# Altium project QUANTUM_PCI_v1.PrjPcb (part 1 of 3)
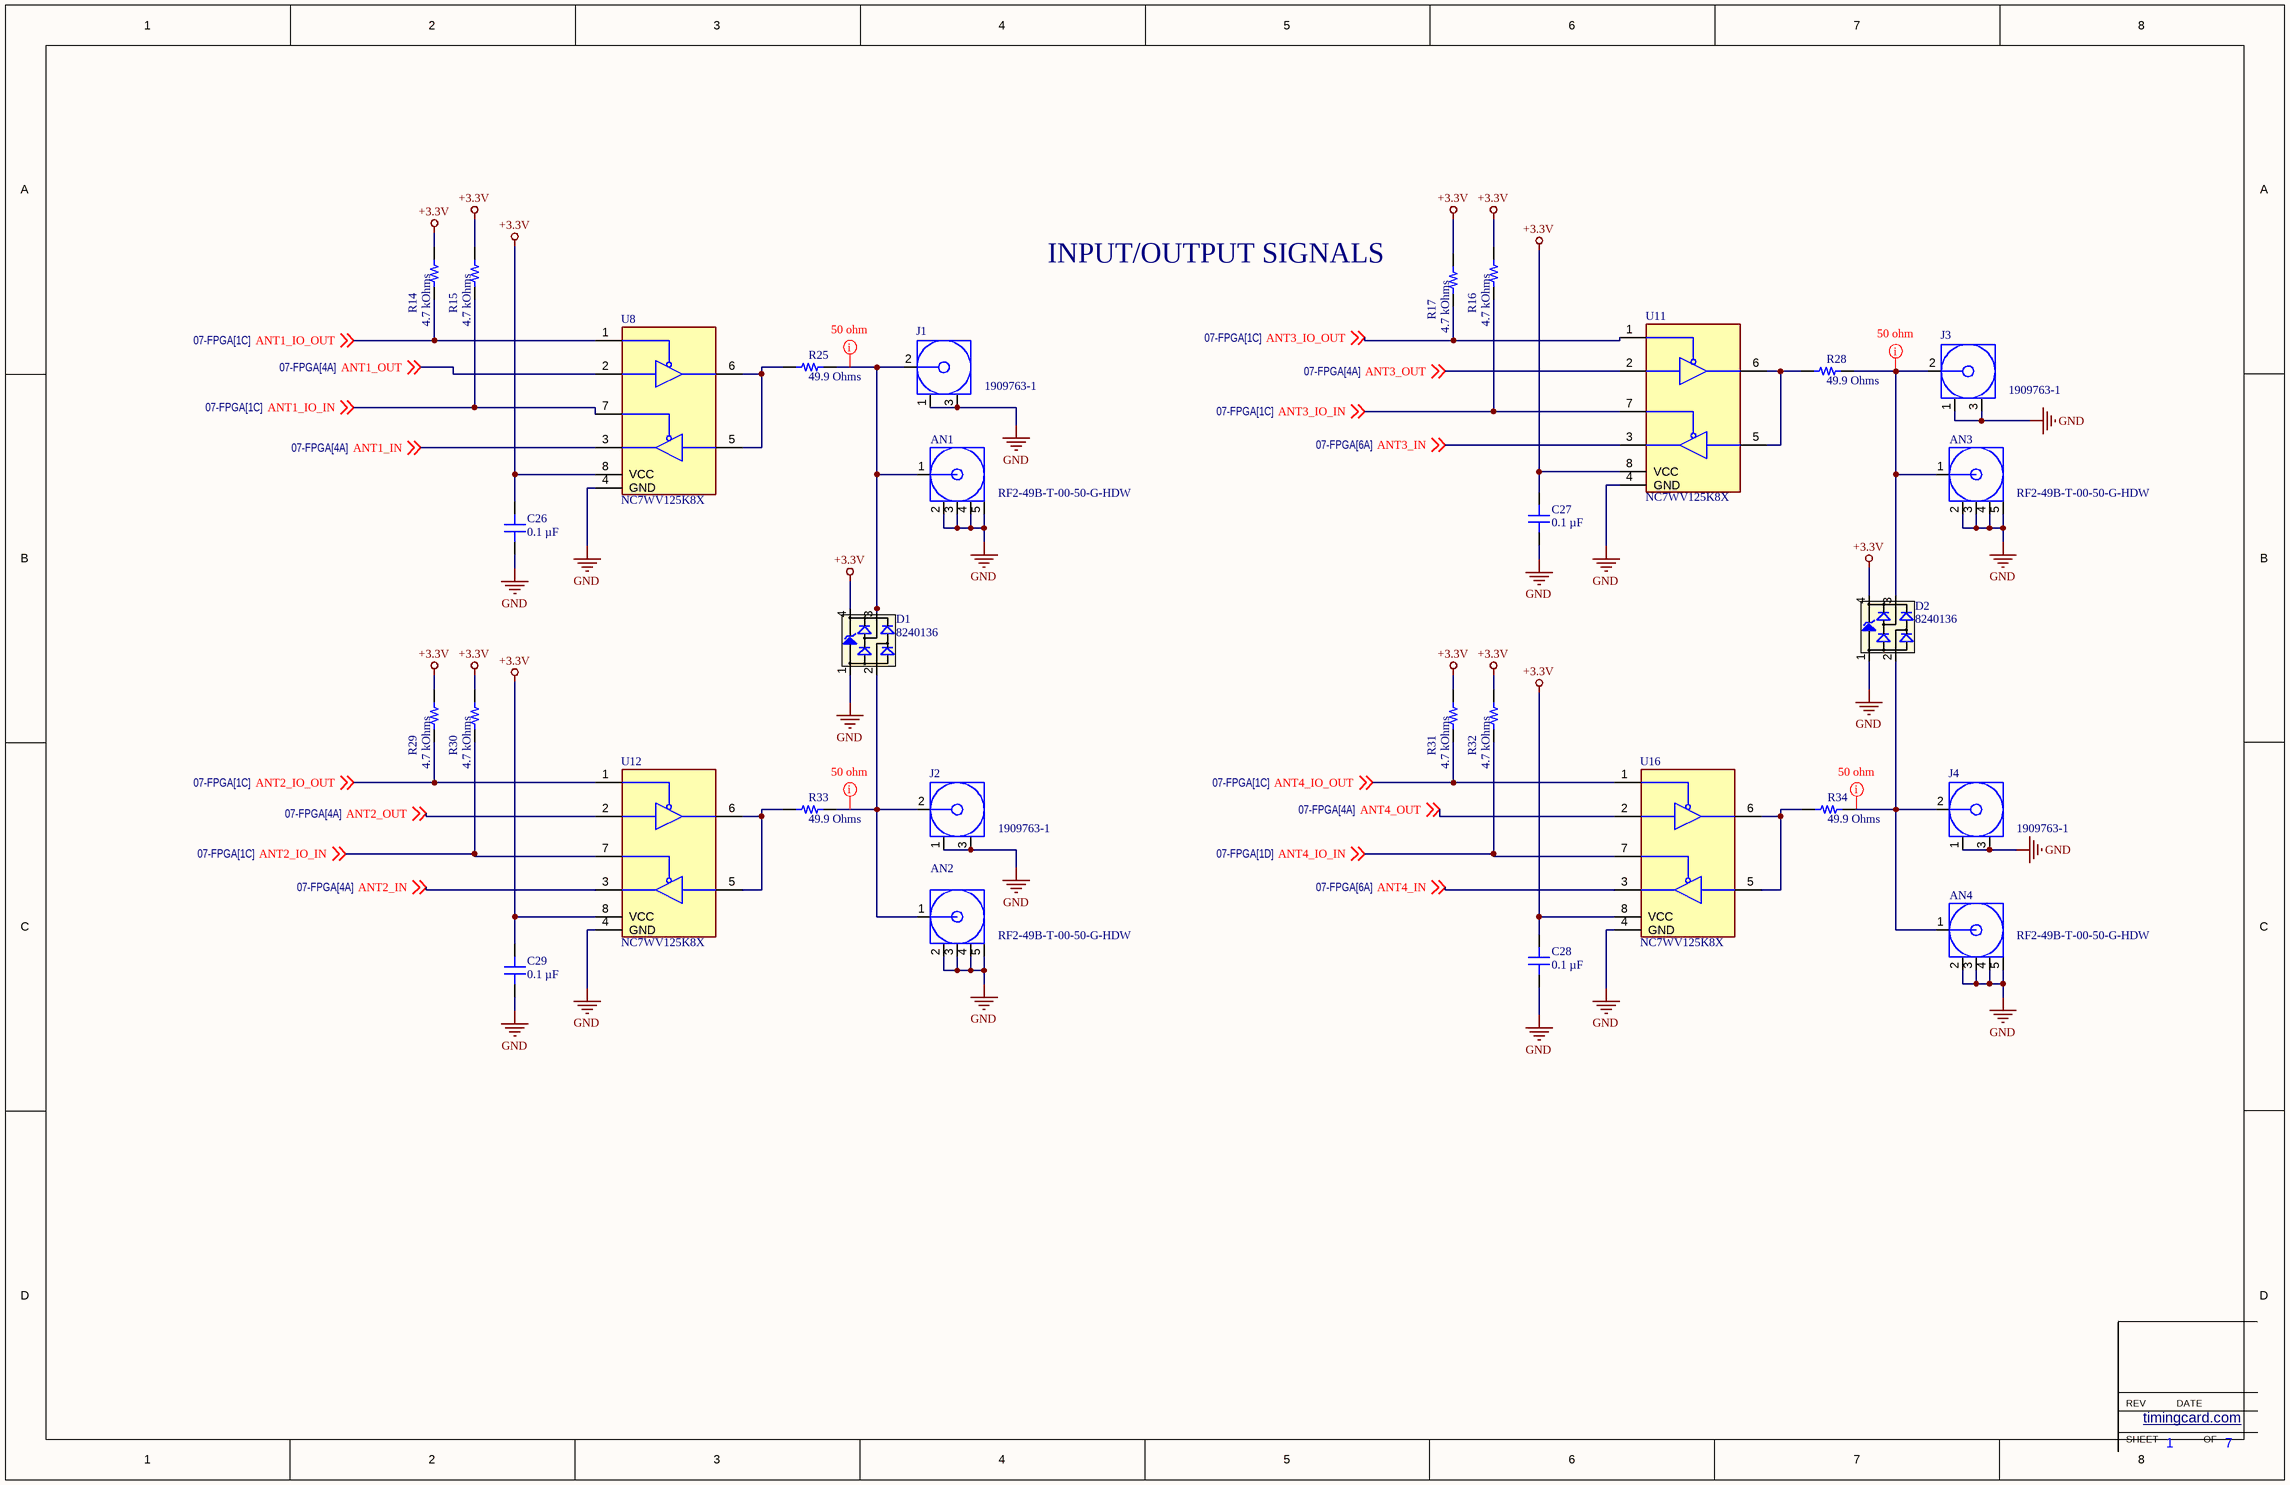
[diagram p0: 01-USER_IO.SchDoc]
TENSH: ТЕНШ.467883.01; Revision: Rev. 1.1
9 sheets, 379 parts. Net scope: global (net labels, ports and power ports of the same name join across sheets).
Board file: Quantum_PCI_v1.PcbDoc
Sheets:
  01-USER_IO.SchDoc
  03-POWER.SchDoc
  04-PCIe_JTAG.SchDoc
  05-GPS_IMU_SENSORS.SchDoc
  07-FPGA.SchDoc
  08-DIPSwitches_I2C.SchDoc
  09-USBUart_PPSMUX_UARTMUX.SchDoc
  10-M2_GPS.SchDoc
  11-M2_RCB_MUX.SchDoc

## Sheet 01-USER_IO.SchDoc
size Tabloid; DocumentNumber: 1; SheetNumber: 1; SheetTotal: 7

### Parts
AN1  RF2-49B-T-00-50-G-HDW  [RF249BT0050GHDW]
AN2  RF2-49B-T-00-50-G-HDW  [RF249BT0050GHDW]
AN3  RF2-49B-T-00-50-G-HDW  [RF249BT0050GHDW]
AN4  RF2-49B-T-00-50-G-HDW  [RF249BT0050GHDW]
C26  0.1 µF  [CAP 0402_1005]
C27  0.1 µF  [CAP 0402_1005]
C28  0.1 µF  [CAP 0402_1005]
C29  0.1 µF  [CAP 0402_1005]
D1  8240136  [SOT143-4L]
D2  8240136  [SOT143-4L]
J1  1909763-1  [TECO-1909763-1_V]
J2  1909763-1  [TECO-1909763-1_V]
J3  1909763-1  [TECO-1909763-1_V]
J4  1909763-1  [TECO-1909763-1_V]
R14  4.7 kOhms  [YAGEO RES 0402_1005]
R15  4.7 kOhms  [YAGEO RES 0402_1005]
R16  4.7 kOhms  [YAGEO RES 0402_1005]
R17  4.7 kOhms  [YAGEO RES 0402_1005]
R25  49.9 Ohms  [YAGEO RES 0402_1005]
R28  49.9 Ohms  [YAGEO RES 0402_1005]
R29  4.7 kOhms  [YAGEO RES 0402_1005]
R30  4.7 kOhms  [YAGEO RES 0402_1005]
R31  4.7 kOhms  [YAGEO RES 0402_1005]
R32  4.7 kOhms  [YAGEO RES 0402_1005]
R33  49.9 Ohms  [YAGEO RES 0402_1005]
R34  49.9 Ohms  [YAGEO RES 0402_1005]
U8  NC7WV125K8X  [SOP50P310X90-8N]
U11  NC7WV125K8X  [SOP50P310X90-8N]
U12  NC7WV125K8X  [SOP50P310X90-8N]
U16  NC7WV125K8X  [SOP50P310X90-8N]

### Nets
+3.3V: C26.1 C27.1 C28.1 C29.1 D1.4(VDD) D2.4(VDD) R14.1 R15.1 R16.1 R17.1 R29.1 R30.1 R31.1 R32.1 U8.8(VCC) U11.8(VCC) U12.8(VCC) U16.8(VCC)
GND: AN1.2 AN1.3 AN1.4 AN1.5 AN2.2 AN2.3 AN2.4 AN2.5 AN3.2 AN3.3 AN3.4 AN3.5 AN4.2 AN4.3 AN4.4 AN4.5 C26.2 C27.2 C28.2 C29.2 D1.1(GND) D2.1(GND) J1.1 J1.3 J2.1 J2.3 J3.1 J3.3 J4.1 J4.3 U8.4(GND) U11.4(GND) U12.4(GND) U16.4(GND)
ANT1_IN: U8.3 ; off-sheet ANT1_IN
ANT1_IO_IN: R15.2 U8.7 ; off-sheet ANT1_IO_IN
ANT1_IO_OUT: R14.2 U8.1 ; off-sheet ANT1_IO_OUT
ANT1_OUT: U8.2 ; off-sheet ANT1_OUT
ANT2_IN: U12.3 ; off-sheet ANT2_IN
ANT2_IO_IN: R30.2 U12.7 ; off-sheet ANT2_IO_IN
ANT2_IO_OUT: R29.2 U12.1 ; off-sheet ANT2_IO_OUT
ANT2_OUT: U12.2 ; off-sheet ANT2_OUT
ANT3_IN: U11.3 ; off-sheet ANT3_IN
ANT3_IO_IN: R16.2 U11.7 ; off-sheet ANT3_IO_IN
ANT3_IO_OUT: R17.2 U11.1 ; off-sheet ANT3_IO_OUT
ANT3_OUT: U11.2 ; off-sheet ANT3_OUT
ANT4_IN: U16.3 ; off-sheet ANT4_IN
ANT4_IO_IN: R32.2 U16.7 ; off-sheet ANT4_IO_IN
ANT4_IO_OUT: R31.2 U16.1 ; off-sheet ANT4_IO_OUT
ANT4_OUT: U16.2 ; off-sheet ANT4_OUT
NetAN1_1: AN1.1 D1.3(I/O2) J1.2 R25.2
NetAN2_1: AN2.1 D1.2(I/O1) J2.2 R33.2
NetAN3_1: AN3.1 D2.3(I/O2) J3.2 R28.2
NetAN4_1: AN4.1 D2.2(I/O1) J4.2 R34.2
NetR25_1: R25.1 U8.5 U8.6
NetR28_1: R28.1 U11.5 U11.6
NetR33_1: R33.1 U12.5 U12.6
NetR34_1: R34.1 U16.5 U16.6

### Layout directives
net class S50: NetAN1_1, NetAN2_1, NetAN3_1, NetAN4_1

### Notes on the sheet
- INPUT/OUTPUT SIGNALS
- SHEET
- REV
- timingcard.com <http://timingcard.com>
- DATE
- OF

### Library data of the parts
AN1-AN4 = RF2-49B-T-00-50-G-HDW: Connector; Manufacturer_Name: Adam Tech; Datasheet Link: https://www.digikey.com/en/products/detail/adam-tech/RF2-49B-T-00-50-G-HDW/9831420?msockid=3e3afa68a50969ca3057ef1ca4c9684b; Height: 10.958mm; Manufacturer_Part_Number: RF2-49B-T-00-50-G-HDW; Arrow Part Number: RF2-49B-T-00-50-G-HDW; Arrow Price/Stock: https://www.arrow.com/en/products/rf2-49b-t-00-50-g-hdw/adam-tech?region=nac
C26-C29 = CC0402KRX7R9BB104: CAP CER 0.1UF 50V X7R 0402; manufacturer: Yageo; Tolerance: ±10%; Capacitance: 0.1 µF; series: CC; packaging: TapeAndReel; Part Number: CC0402KRX7R9BB104; Value: 0.1 µF; Applications: General Purpose; componentlink1description: Datasheet; componentlink1url: https://www.yageo.com/upload/media/product/productsearch/datasheet/mlcc/UPY-GPHC_X7R_6.3V-to-50V_18.pdf; componentlink2description: DigiKey Link; componentlink2url: https://www.digikey.com/en/products/detail/yageo/CC0402KRX7R9BB104/5883371; Device Package: 0402 (1005 Metric); lastupdated: 09.02.2024 20:04:27; Lifecycle Status: Active; Minimum Order: 10; Mounting Type: Surface Mount, MLCC; Operating Temperature: -55°C ~ 125°C; Package / Case: 0402 (1005 Metric); partid: 8451; Part Status: Active; price: 0.01; Size / Dimension: 0.039" L x 0.020" W (1.00mm x 0.50mm); Supplier 1: DigiKey; Supplier Part Number 1: 311-3566-1-ND; Temperature Coefficient: X7R; Thickness (Max): 0.022" (0.55mm); Voltage - Rated: 50V
D1 D2 = CMP-1486-00002-1: TVS Diode WE-TVS-HS, VRWM=3.3V; Manufacturer: Wuerth Elektronik; Reverse Stand Off Voltage: 3.3V; PartNumber: 8240136; ComponentLink1Description: Manufacturer URL; PackageReference: SOT143-4L; ComponentLink1URL: http://www.we-online.com; ComponentLink2Description: Datasheet; ComponentLink2URL: http://katalog.we-online.de/kataloge/eisos/media/pdf/8240136.pdf
J1-J4 = CMP-2000-07505-1: Ultra Miniature Coaxial Connector Jack, 60 V, 50 Ohm, -40 to 90 degC, RoHS, Tape and Reel; Manufacturer: TE Connectivity; Gender: Female; PCB Mounting Orientation: Vertical; Body Material: LiquidCrystalPolymer; Case\/Package: SMD/SMT; Impedance: 50Ohm; Max Frequency: 6GHz; Body Plating: Gold; Dielectric Material: Polymer; Orientation: Straight; Mount: SurfaceMount; Length: 3mm; Packaging: TapeandReel; Connector Type: Jack; Lead Free: LeadFree; Package Quantity: 1; Termination: SMD/SMT; Contact Material: CopperAlloy; Fastening Type: Pull; RoHSCompliant: true; Max Operating Temperature: 90degC; Datasheet URL: http://www.te.com/commerce/DocumentDelivery/DDEController?Action=srchrtrv&DocNm=1909763&DocType=Customer+Drawing&DocLang=English; Contact Plating: Gold; Mounting Technology: SurfaceMount; Package Reference: TECO-1909763-1; Insulation Material: Thermoplastic; Min Operating Temperature: -40degC; Manufacturer URL: http://www.te.com/; ELV: Compliant; Datasheet Version: Rev. B2, 11/2015; Radiation Hardening: No; Package Description: 3-Pin Surface Mount Device, Body 2.6 x 2.6 mm; Housing Colour: Beige
R14-R17 R29-R32 = RC0402FR-074K7L: RES 4.7K OHM 1% 1/16W 0402; Manufacturer: Yageo; Power (Watts): 0.063W, 1/16W; Temperature Coefficient: ±100ppm/°C; Part Number: RC0402FR-074K7L; Value: 4.7 kOhms; ComponentLink1Description: Datasheet; ComponentLink1URL: https://www.yageo.com/upload/media/product/productsearch/datasheet/rchip/PYu-RC_Group_51_RoHS_L_10.pdf; ComponentLink2Description: DigiKey Link; ComponentLink2URL: https://www.digikey.com/en/products/detail/yageo/RC0402FR-074K7L/2827563; Composition: Thick Film; Device Package: 0402 (1005 Metric); Features: Moisture Resistant; Height - Seated (Max): 0.016" (0.40mm); LastUpdated: 25.07.2024 9:18:11; Lifecycle Status: Active; Minimum Order: 1; Number of Terminations: 2; Operating Temperature: -55°C ~ 155°C; Package / Case: 0402 (1005 Metric); Packaging: CutTape; PartId: 17603; Part Status: Active; Price: 0.01; Resistance: 4.7 kOhms; Series: RC_L; Size / Dimension: 0.039" L x 0.020" W (1.00mm x 0.50mm); Supplier 1: DigiKey; Supplier Part Number 1: 311-4.7KLRCT-ND; Supplier Device Package: 0402; Tolerance: ±1%
R25 R28 R33 R34 = RC0402FR-0749R9L: RES 49.9 OHM 1% 1/16W 0402; Manufacturer: Yageo; Power (Watts): 0.063W, 1/16W; Temperature Coefficient: ±100ppm/°C; Packaging: CutTape; ComponentLink2Description: DigiKey Link; ComponentLink1Description: Datasheet; ComponentLink2URL: https://www.digikey.com/en/products/detail/yageo/RC0402FR-0749R9L/726621; ComponentLink1URL: https://www.yageo.com/upload/media/product/productsearch/datasheet/rchip/PYu-RC_Group_51_RoHS_L_10.pdf; Part Number: RC0402FR-0749R9L; Value: 49.9 Ohms; Composition: Thick Film; Device Package: 0402 (1005 Metric); Features: Moisture Resistant; Height - Seated (Max): 0.016" (0.40mm); LastUpdated: 25.07.2024 9:18:11; Lifecycle Status: Active; Minimum Order: 1; Number of Terminations: 2; Operating Temperature: -55°C ~ 155°C; Package / Case: 0402 (1005 Metric); PartId: 17605; Part Status: Active; Price: 0.01; Resistance: 49.9 Ohms; Series: RC_L; Size / Dimension: 0.039" L x 0.020" W (1.00mm x 0.50mm); Supplier 1: DigiKey; Supplier Part Number 1: 311-49.9LRCT-ND; Supplier Device Package: 0402; Tolerance: ±1%
U8 U11 U12 U16 = NC7WV125K8X: Integrated Circuit; Manufacturer_Name: ON Semiconductor; Datasheet Link: https://www.mouser.com/datasheet/2/308/NC7WV125-1301459.pdf; Height: 0.9mm; Manufacturer_Part_Number: NC7WV125K8X; Mouser Part Number: 512-NC7WV125K8X; Mouser Price/Stock: https://www.mouser.com/Search/Refine.aspx?Keyword=512-NC7WV125K8X; Arrow Part Number: NC7WV125K8X; Arrow Price/Stock: https://www.arrow.com/en/products/nc7wv125k8x/on-semiconductor

## Sheet 03-POWER.SchDoc
size A2; Customer: 01910; SPICEModelCache: <root> / <DocumentId>GNEMVTBT</DocumentId> / <CacheFrame Number="0"> / <Model Name="emk105bj105_v-f" Kind="CKT"> / <Text>* EMK105BJ105_V-F     SPICE MODEL  ( General Type ) / *-------------------------------------------------------------------------------------------------------- / * Model Generated by TAIYO YUDEN Corporation (http://www.ty-top.com) / * Version 1.0 / * TAIYO YUDEN Control No. 170508_130520 / * Copyright(c) 2012 TAIYO YUDEN CO.,LTD. All Rights Reserved. / *-------------------------------------------------------------------------------------------------------- / * / * Products Name : Multilayer Ceramic Capacitors / * / * Characteristics : / *     Capacitance : 1 uF , Rated Voltage : 16V , TCC : X5R / *     Case Size : 1.0 x 0.5 / 0.039 x 0.02 [mm/inch] , Thickness : 0.5 / 0.02 [mm/inch] / *     (Conditions: Temperature = 25 degC , DC Bias Current/Voltage = 0A / 0V) / * / * Frequency Range : 40Hz - 3GHz / * / * External Node Assignments : / * / *  1  o---| |---o  2 / * / *-------------------------------------------------------------------------------------------------------- / .SubCkt EMK105BJ105_V-F 1 2 / **************************** / C0 1 110 0.68309u / Cm 1 101 0.26053u / C1 101 102 0.94076u / Rc1 101 102 1.9029k / C2 102 103 0.66707u / Rc2 102 103 120.36 / C3 103 110 0.57203u / Rc3 103 110 2.1097 / C2m 1 301 0.1871u / C21 301 302 3.2494u / Rc21 301 302 1.1117k / C22 302 303 2.1014u / Rc22 302 303 1.484k / C23 303 304 2.1172u / Rc23 303 304 1.3876k / C24 304 305 0.75729u / Rc24 304 305 332.59 / C25 305 306 0.94401u / Rc25 305 306 249.09 / C26 306 307 0.34674u / Rc26 306 307 28.352 / C27 307 308 0.37158u / Rc27 307 308 19.989 / C28 308 309 0.17933u / Rc28 308 309 31.748 / C29 309 110 0.016445u / Rc29 309 110 1.0592 / Rp0 1 110 100Meg / L0 110 120 0.2216n / Lm 120 130 0.1509n / L1 120 121 0.12659n / RL1 121 130 0.85161 / L2 120 122 0.15996n / RL2 122 130 0.42469 / L3 120 123 7.9543n / RL3 123 130 0.54643m / CR 120 124 0.24334u / LR 124 125 0.090738n / RR 125 130 68.076m / CL 130 140 2.7354p / LL 130 140 0.10762n / RL 130 140 50.614 / Rs 140 2 7.5416m / **************************** / .ends EMK105BJ105_V-F</Text> / </Model> / </CacheFrame> / </root>
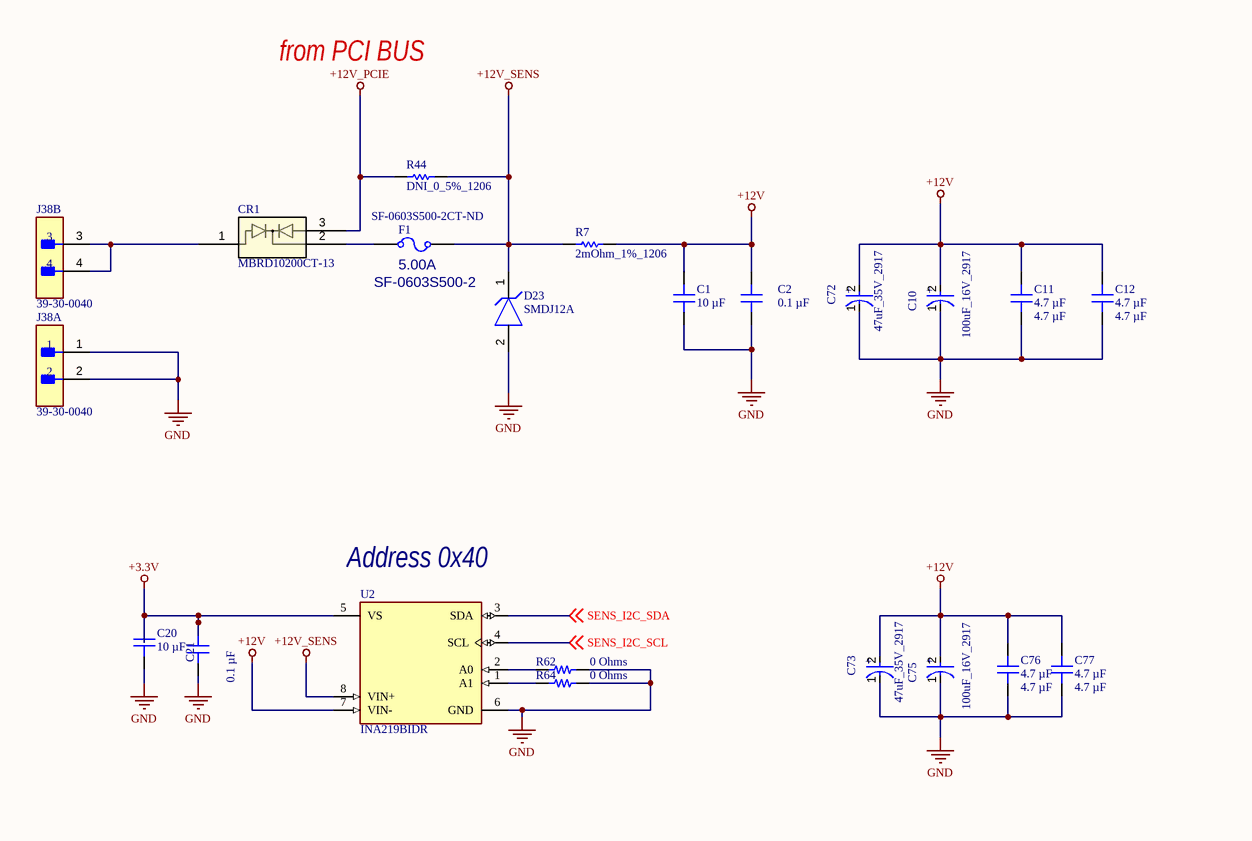
[diagram p1: 03-POWER.SchDoc, left]
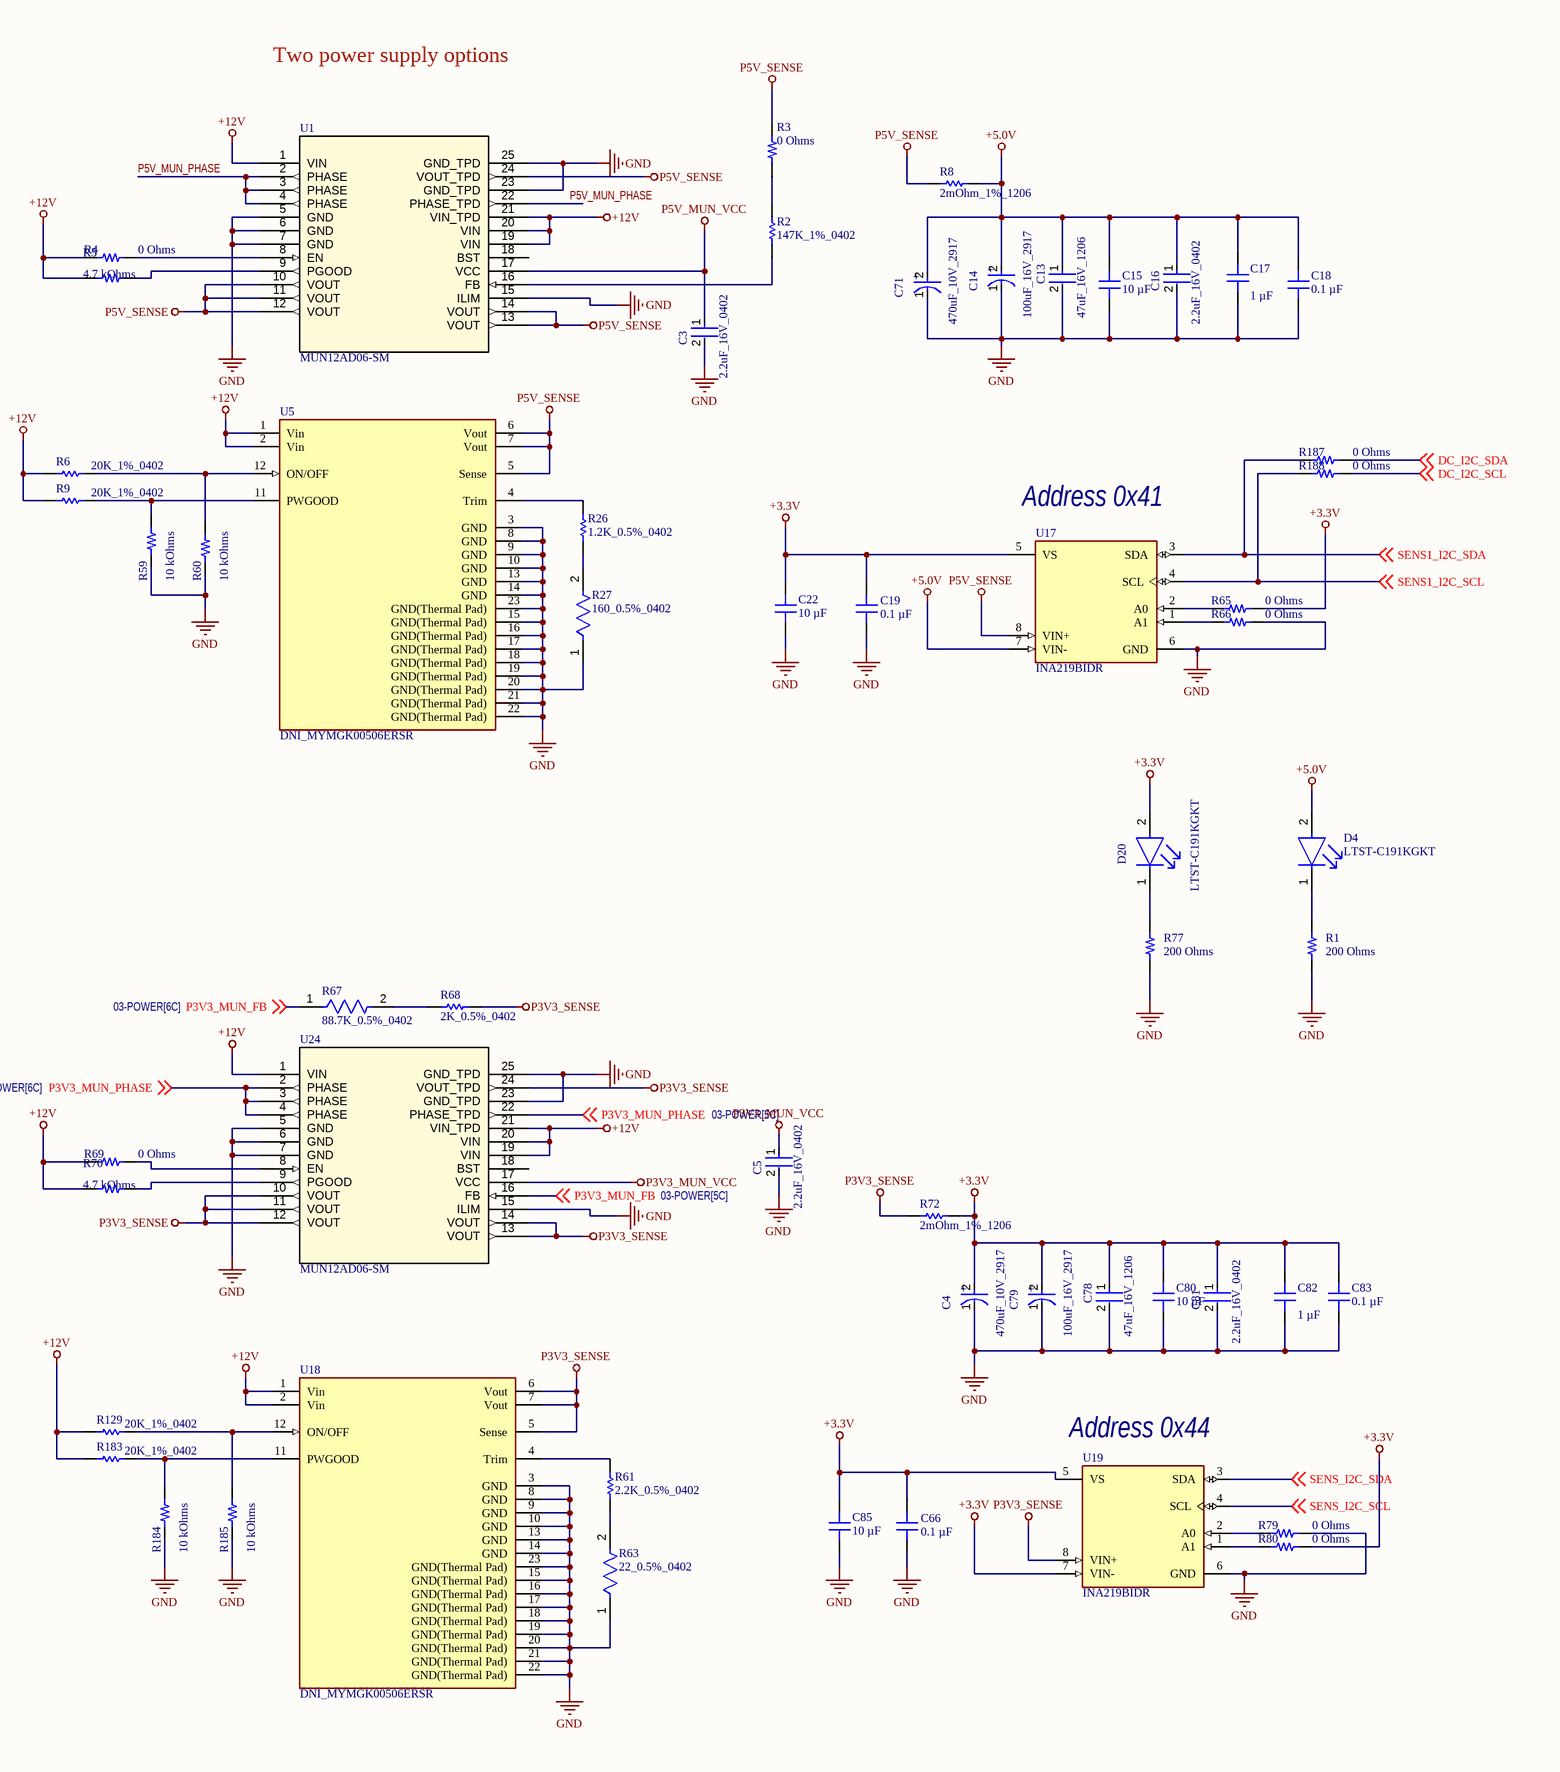
[diagram p2: 03-POWER.SchDoc, right]

### Parts
C1  10 µF  [MURATA GRM21B 0805_2012]
C2  0.1 µF  [CAP 0402_1005]
C3  2.2uF_16V_0402  [FP-C1005-050-0_05-IPC_A]
C4  470uF_10V_2917  [FP-TAJE-MFG]
C5  2.2uF_16V_0402  [FP-C1005-050-0_05-IPC_A]
C10  100uF_16V_2917  [FP-T495D107K016ATE125-MFG]
C11  4.7 µF  [MURATA CAP GRM31C 1206_3216]
C12  4.7 µF  [MURATA CAP GRM31C 1206_3216]
C13  47uF_16V_1206  [FP-C3216-160-0_2-MFG]
C14  100uF_16V_2917  [FP-T495D107K016ATE125-MFG]
C15  10 µF  [MURATA GRM21B 0805_2012]
C16  2.2uF_16V_0402  [FP-C1005-050-0_05-IPC_A]
C17  1 µF  [CAP 0402_1005]
C18  0.1 µF  [CAP 0402_1005]
C19  0.1 µF  [CAP 0402_1005]
C20  10 µF  [MURATA GRM21B 0805_2012]
C21  0.1 µF  [CAP 0402_1005]
C22  10 µF  [MURATA GRM21B 0805_2012]
C66  0.1 µF  [CAP 0402_1005]
C71  470uF_10V_2917  [FP-TAJE-MFG]
C72  47uF_35V_2917  [FP-T521X476M035ATE030-MFG]
C73  47uF_35V_2917  [FP-T521X476M035ATE030-MFG]
C75  100uF_16V_2917  [FP-T495D107K016ATE125-MFG]
C76  4.7 µF  [MURATA CAP GRM31C 1206_3216]
C77  4.7 µF  [MURATA CAP GRM31C 1206_3216]
C78  47uF_16V_1206  [FP-C3216-160-0_2-MFG]
C79  100uF_16V_2917  [FP-T495D107K016ATE125-MFG]
C80  10 µF  [MURATA GRM21B 0805_2012]
C81  2.2uF_16V_0402  [FP-C1005-050-0_05-IPC_A]
C82  1 µF  [CAP 0402_1005]
C83  0.1 µF  [CAP 0402_1005]
C85  10 µF  [MURATA GRM21B 0805_2012]
CR1  MBRD10200CT-13  [TO252(DPAK)_DIO]
D4  LTST-C191KGKT  [FP-LTST-C191KGKT-MFG]
D20  LTST-C191KGKT  [FP-LTST-C191KGKT-MFG]
D23  SMDJ12A  [FP-DO-214AB_SMC_J-Bend-MFG]
F1  value 5.00A  MFG PART NUM: SF-0603S500-2  Supplier Part Number 1: SF-0603S500-2CT-ND  [FUSM1608X60N]  (hidden comment: FUSE_0603_5.00A)
J38  39-30-0040  [FP-39-30-0040-MFG]  (parts A,B of 2)
R1  200 Ohms  [YAGEO RES 0402_1005]
R2  147K_1%_0402  [RESC1005X40X25ML05T10]
R3  0 Ohms  [YAGEO RES 0402_1005]
R4  0 Ohms  [YAGEO RES 0402_1005]
R5  4.7 kOhms  [YAGEO RES 0402_1005]
R6  20K_1%_0402  [RESC1005X40X25NL10T10]
R7  2mOhm_1%_1206  [RESC3216X89X64NL25T25]
R8  2mOhm_1%_1206  [RESC3216X89X64NL25T25]
R9  20K_1%_0402  [RESC1005X40X25NL10T10]
R26  1.2K_0.5%_0402  [RESC1005X40X25ML10T10]
R27  160_0.5%_0402  [FP-RT0402-MFG]
R44  DNI_0_5%_1206  [RESC3116X65X50ML20T20]  (no BOM)
R59  10 kOhms  [YAGEO RES 0402_1005]
R60  10 kOhms  [YAGEO RES 0402_1005]
R61  2.2K_0.5%_0402  [RESC1005X40X25ML10T10]
R62  0 Ohms  [YAGEO RES 0402_1005]
R63  22_0.5%_0402  [FP-RG1005-IPC_A]
R64  0 Ohms  [YAGEO RES 0402_1005]
R65  0 Ohms  [YAGEO RES 0402_1005]
R66  0 Ohms  [YAGEO RES 0402_1005]
R67  88.7K_0.5%_0402  [FP-RT0402-MFG]
R68  2K_0.5%_0402  [RESC1005X35X25LL10T10]
R69  0 Ohms  [YAGEO RES 0402_1005]
R70  4.7 kOhms  [YAGEO RES 0402_1005]
R72  2mOhm_1%_1206  [RESC3216X89X64NL25T25]
R77  200 Ohms  [YAGEO RES 0402_1005]
R79  0 Ohms  [YAGEO RES 0402_1005]
R80  0 Ohms  [YAGEO RES 0402_1005]
R129  20K_1%_0402  [RESC1005X40X25NL10T10]
R183  20K_1%_0402  [RESC1005X40X25NL10T10]
R184  10 kOhms  [YAGEO RES 0402_1005]
R185  10 kOhms  [YAGEO RES 0402_1005]
R187  0 Ohms  [YAGEO RES 0402_1005]
R188  0 Ohms  [YAGEO RES 0402_1005]
U1  MUN12AD06-SM  [MUN12AD06-SM_CYN]
U2  INA219BIDR  [FP-D0008A-MFG]
U5  DNI_MYMGK00506ERSR  [FP-MYMGK-12-MFG]  (no BOM)
U17  INA219BIDR  [FP-D0008A-MFG]
U18  DNI_MYMGK00506ERSR  [FP-MYMGK-12-MFG]  (no BOM)
U19  INA219BIDR  [FP-D0008A-MFG]
U24  MUN12AD06-SM  [MUN12AD06-SM_CYN]

### Nets
+3.3V: C4.2(A) C19.2 C20.2 C21.2 C22.2 C66.2 C78.1 C79.2(A) C80.2 C81.1 C82.2 C83.1 C85.2 D20.2(A) R65.2 R72.2 R80.2 U2.5(VS) U17.5(VS) U19.5(VS) U19.7(VIN-)
+5.0V: C13.1 C14.2(A) C15.2 C16.1 C17.2 C18.1 C71.2(A) D4.2(A) R8.2 U17.7(VIN-)
+12V: C1.1 C2.2 C10.2(A) C11.2 C12.2 C72.2(A) C73.2(A) C75.2(A) C76.2 C77.2 R4.1 R5.2 R6.1 R7.2 R9.1 R69.1 R70.2 R129.1 R183.1 U1.1(VIN) U1.19(VIN) U1.20(VIN) U1.21(VIN_TPD) U2.7(VIN-) U5.1(Vin) U5.2(Vin) U18.1(Vin) U18.2(Vin) U24.1(VIN) U24.19(VIN) U24.20(VIN) U24.21(VIN_TPD)
+12V_PCIE: CR1.3 R44.1
+12V_SENS: D23.1(C) F1.2 R7.1 R44.2 U2.8(VIN+)
GND: C1.2 C2.1 C3.2 C4.1(C) C5.2 C10.1(C) C11.1 C12.1 C13.2 C14.1(C) C15.1 C16.2 C17.1 C18.2 C19.1 C20.1 C21.1 C22.1 C66.1 C71.1(C) C72.1(C) C73.1(C) C75.1(C) C76.1 C77.1 C78.2 C79.1(C) C80.1 C81.2 C82.1 C83.2 C85.1 D23.2(A) J38.1 J38.2 R1.1 R27.1 R59.1 R60.1 R62.2 R63.1 R64.2 R66.2 R77.1 R79.2 R184.1 R185.1 U1.5(GND) U1.6(GND) U1.7(GND) U1.15(ILIM) U1.23(GND_TPD) U1.25(GND_TPD) U2.6(GND) U5.3(GND) U5.8(GND) U5.9(GND) U5.10(GND) U5.13(GND) U5.14(GND) U5.15(GND(Thermal_Pad)) U5.16(GND(Thermal_Pad)) U5.17(GND(Thermal_Pad)) U5.18(GND(Thermal_Pad)) U5.19(GND(Thermal_Pad)) U5.20(GND(Thermal_Pad)) U5.21(GND(Thermal_Pad)) U5.22(GND(Thermal_Pad)) U5.23(GND(Thermal_Pad)) U17.6(GND) U18.3(GND) U18.8(GND) U18.9(GND) U18.10(GND) U18.13(GND) U18.14(GND) U18.15(GND(Thermal_Pad)) U18.16(GND(Thermal_Pad)) U18.17(GND(Thermal_Pad)) U18.18(GND(Thermal_Pad)) U18.19(GND(Thermal_Pad)) U18.20(GND(Thermal_Pad)) U18.21(GND(Thermal_Pad)) U18.22(GND(Thermal_Pad)) U18.23(GND(Thermal_Pad)) U19.6(GND) U24.5(GND) U24.6(GND) U24.7(GND) U24.15(ILIM) U24.23(GND_TPD) U24.25(GND_TPD)
P3V3_MUN_VCC: C5.1 U24.17(VCC)
P3V3_SENSE: R68.2 R72.1 U18.5(Sense) U18.6(Vout) U18.7(Vout) U19.8(VIN+) U24.10(VOUT) U24.11(VOUT) U24.12(VOUT) U24.13(VOUT) U24.14(VOUT) U24.24(VOUT_TPD)
P5V_MUN_VCC: C3.1 U1.17(VCC)
P5V_SENSE: R3.2 R8.1 U1.10(VOUT) U1.11(VOUT) U1.12(VOUT) U1.13(VOUT) U1.14(VOUT) U1.24(VOUT_TPD) U5.5(Sense) U5.6(Vout) U5.7(Vout) U17.8(VIN+)
DC_I2C_SCL: R188.2 ; off-sheet DC_I2C_SCL
DC_I2C_SDA: R187.2 ; off-sheet DC_I2C_SDA
P3V3_MUN_FB: R67.1 U24.16(FB) ; off-sheet P3V3_MUN_FB
P3V3_MUN_PHASE: U24.2(PHASE) U24.3(PHASE) U24.4(PHASE) U24.22(PHASE_TPD) ; off-sheet P3V3_MUN_PHASE
P5V_MUN_PHASE: U1.2(PHASE) U1.3(PHASE) U1.4(PHASE) U1.22(PHASE_TPD)
SENS1_I2C_SCL: R188.1 U17.4(SCL) ; off-sheet SENS1_I2C_SCL
SENS1_I2C_SDA: R187.1 U17.3(SDA) ; off-sheet SENS1_I2C_SDA
SENS_I2C_SCL: U2.4(SCL) U19.4(SCL) ; off-sheet SENS_I2C_SCL
SENS_I2C_SDA: U2.3(SDA) U19.3(SDA) ; off-sheet SENS_I2C_SDA
NetCR1_1: CR1.1 J38.3 J38.4
NetCR1_2: CR1.2 F1.1
NetD4_1: D4.1(C) R1.2
NetD20_1: D20.1(C) R77.2
NetR2_1: R2.1 U1.16(FB)
NetR2_2: R2.2 R3.1
NetR4_2: R4.2 U1.8(EN)
NetR5_1: R5.1 U1.9(PGOOD)
NetR6_2: R6.2 R60.2 U5.12(ON/OFF)
NetR9_2: R9.2 R59.2 U5.11(PWGOOD)
NetR26_1: R26.1 R27.2
NetR26_2: R26.2 U5.4(Trim)
NetR61_1: R61.1 R63.2
NetR61_2: R61.2 U18.4(Trim)
NetR62_1: R62.1 U2.2(A0)
NetR64_1: R64.1 U2.1(A1)
NetR65_1: R65.1 U17.2(A0)
NetR66_1: R66.1 U17.1(A1)
NetR67_2: R67.2 R68.1
NetR69_2: R69.2 U24.8(EN)
NetR70_1: R70.1 U24.9(PGOOD)
NetR79_1: R79.1 U19.2(A0)
NetR80_1: R80.1 U19.1(A1)
NetR129_2: R129.2 R185.2 U18.12(ON/OFF)
NetR183_2: R183.2 R184.2 U18.11(PWGOOD)

Not connected (* = marked no-connect by the designer): U1 18(BST); U24 18(BST)

### Notes on the sheet
- from PCI BUS
- Two power supply options
- (near U2) Address 0x40
- (near U17) Address 0x41
- (near U19) Address 0x44
- SHEET
- REV
- timingcard.com <http://timingcard.com>
- DATE
- OF
- (in symbol CMP-2000-07207-2) +
- (in symbol CMP-03016-000019-1) +
- (in symbol CMP-04424-000243-1) +

### Library data of the parts
C1 C15 C20 C22 C80 C85 = GRM21BR61E106KA73L: CAP CER 10UF 25V X5R 0805; manufacturer: Murata Electronics; Tolerance: ±10%; Supplier 1: DigiKey; Supplier Part Number 1: 490-5523-1-ND; Value: 10 µF; Part Number: GRM21BR61E106KA73L; Applications: General Purpose; Capacitance: 10 µF; componentlink1description: Datasheet; componentlink1url: https://search.murata.co.jp/Ceramy/image/img/A01X/G101/ENG/GRM21BR61E106KA73-01.pdf; componentlink2description: DigiKey Link; componentlink2url: https://www.digikey.com/en/products/detail/murata-electronics/GRM21BR61E106KA73L/2334874; Device Package: 0805 (2012 Metric); lastupdated: 27.08.2024 9:29:56; Lifecycle Status: Active; Minimum Order: 1; Mounting Type: Surface Mount, MLCC; Operating Temperature: -55°C ~ 85°C; Package / Case: 0805 (2012 Metric); packaging: TapeAndReel; partid: 8913; Part Status: Active; price: 0.04; series: GRM; Size / Dimension: 0.079" L x 0.049" W (2.00mm x 1.25mm); Temperature Coefficient: X5R; Thickness (Max): 0.053" (1.35mm); Voltage - Rated: 25V
C2 C18 C19 C21 C66 C83 = CC0402KRX7R9BB104: as C26 on sheet 01-USER_IO; Part Number: CC0402KRX7R9BB104; Value: 0.1 µF; Applications: General Purpose; Capacitance: 0.1 µF; componentlink1description: Datasheet; componentlink1url: https://www.yageo.com/upload/media/product/productsearch/datasheet/mlcc/UPY-GPHC_X7R_6.3V-to-50V_18.pdf; componentlink2description: DigiKey Link; componentlink2url: https://www.digikey.com/en/products/detail/yageo/CC0402KRX7R9BB104/5883371; Device Package: 0402 (1005 Metric); lastupdated: 09.02.2024 20:04:27; Lifecycle Status: Active; Minimum Order: 10; Mounting Type: Surface Mount, MLCC; Operating Temperature: -55°C ~ 125°C; Package / Case: 0402 (1005 Metric); packaging: TapeAndReel; partid: 8451; Part Status: Active; price: 0.01; series: CC; Size / Dimension: 0.039" L x 0.020" W (1.00mm x 0.50mm); Supplier 1: DigiKey; Supplier Part Number 1: 311-3566-1-ND; Temperature Coefficient: X7R; Thickness (Max): 0.022" (0.55mm); Voltage - Rated: 50V
C3 C5 C16 C81 = CMP-2000-05998-2: Multilayer Ceramic Capacitors 2.2μF ±10% 16V X5R SMD 0402; Capacitance: 2.2uF; REACH SVHC: No SVHC; Series: C; Termination: SMD/SMT; Case Code (Imperial): 0402; Depth: 0.5mm; Mount: Surface Mount; Width: 0.02inch; Package Quantity: 1; Dielectric Material: Ceramic; Length: 1mm; Packaging: Tape and Reel; Case Code (Metric): 1005; RoHS Compliant: Yes; Dielectric: X5R; Max Operating Temperature: 85°C; Lead Free: Lead Free; Weight: 2.3E-05oz; Thickness: 0.022inch; Voltage Rating (DC): 16V; Tolerance: 10%; Voltage Rating: 16V; Resistor Type: Ceramic; Height: 0.5mm; Case/Package: 0402; Min Operating Temperature: -55°C
C4 C71 = CMP-04424-000243-1: 470uF 10V  ±10% 500mΩ 2917  SMD Tantalum Capacitor; Leakage Current: 47uA; ESR (Equivalent Series Resistance): 500mR; Polarity: Polar; Construction: Flat; Width: 4.3mm; Mount: Surface Mount; Tolerance: 10%; Max Operating Temperature: 125°C; Min Operating Temperature: -55°C; Length: 7.3mm; Voltage: 10V; Dissipation Factor: 10%; REACH SVHC: No SVHC; Lead Free: Lead Free; Case/Package: 2917; Voltage Rating: 10V; Capacitance: 470uF; Series: TAJ; Height: 4.1mm; RoHS Compliant: Yes; Packaging: Tape and Reel; Voltage Rating (DC): 10V; Radiation Hardening: No; Dielectric Material: Tantalum; Number of Pins: 2; Depth: 4.3mm; Case Code (Metric): 7343; Case Code (Imperial): 2917; Termination: SMD/SMT; Lead Pitch: 4.4mm; Features: General Purpose; Height - Seated (Max): 0.169inch; Package Quantity: 1
C10 C14 C75 C79 = CMP-2000-07207-2: CAP TANT 100UF 10% 16V 2917; Life (Hours): 2000Hour; ESR (Equivalent Series Resistance): 125mR; Polarity: Polar; Dielectric Material: Tantalum; Dissipation Factor: 8%; Capacitance: 100uF; Radiation Hardening: No; RoHS Compliant: Yes; Length: 7.3mm; Features: General Purpose; Packaging: Tape and Reel; Package Quantity: 1; Weight: 0.023634oz; Voltage Rating: 16V; Width: 0.169inch; Case/Package: 2917; Mount: Surface Mount; Voltage: 16V; Min Operating Temperature: -55°C; Tolerance: 10%; REACH SVHC: No SVHC; Height - Seated (Max): 0.122inch; Number of Pins: 2; Construction: Flat; Depth: 4.3mm; Series: T495; Max Operating Temperature: 125°C; Failure Rate: 0.001%; Termination: SMD/SMT; Voltage Rating (DC): 16V; Case Code (Imperial): 2917; Case Code (Metric): 7343; Height: 2.8mm
C11 C12 C76 C77 = GRM31CR71H475KA12L: CAP CER 4.7UF 50V X7R 1206; manufacturer: Murata Electronics; Tolerance: ±10%; Capacitance: 4.7 µF; packaging: TapeAndReel; Part Number: GRM31CR71H475KA12L; Value: 4.7 µF; Applications: General Purpose; componentlink1description: Datasheet; componentlink1url: https://www.murata.com/~/media/webrenewal/support/library/catalog/products/capacitor/mlcc/c02e.ashx?la=en-us; componentlink2description: DigiKey Link; componentlink2url: https://www.digikey.com/en/products/detail/murata-electronics/GRM31CR71H475KA12L/2548209; Device Package: 1206 (3216 Metric); lastupdated: 06.09.2024 2:27:23; Lifecycle Status: Active; Minimum Order: 1; Mounting Type: Surface Mount, MLCC; Operating Temperature: -55°C ~ 125°C; Package / Case: 1206 (3216 Metric); partid: 20010; Part Status: Active; price: 0.07; series: GRM; Size / Dimension: 0.126" L x 0.063" W (3.20mm x 1.60mm); Supplier 1: DigiKey; Supplier Part Number 1: 490-6521-1-ND; Temperature Coefficient: X7R; Thickness (Max): 0.071" (1.80mm); Voltage - Rated: 50V
C13 C78 = CMP-2000-07442-2: Multilayer Ceramic Capacitors 47uF ±20% 16V X5R SMD 1206; Resistor Type: Ceramic; Width: 0.063inch; Case Code (Imperial): 1206; Radiation Hardening: No; Thickness: 0.071inch; Dielectric: X5R; Weight: 0.000571oz; Termination: SMD/SMT; Dielectric Material: Ceramic; Min Operating Temperature: -55°C; Depth: 1.6mm; Case Code (Metric): 3216; Max Operating Temperature: 85°C; RoHS Compliant: Yes; REACH SVHC: No SVHC; Mount: Surface Mount; Lead Free: Lead Free; Height: 1.6mm; Length: 3.2mm; Tolerance: 20%; Voltage Rating (DC): 16V; Capacitance: 47uF; Package Quantity: 1; Construction: Flat; Packaging: Tape and Reel; Series: C; Case/Package: 1206; Voltage Rating: 16V
C17 C82 = CC0402KRX5R8BB105: CAP CER 1UF 25V X5R 0402; manufacturer: Yageo; Tolerance: ±10%; packaging: TapeAndReel; series: CC; Capacitance: 1 µF; Part Number: CC0402KRX5R8BB105; Value: 1 µF; Applications: General Purpose; componentlink1description: Datasheet; componentlink1url: https://www.yageo.com/upload/media/product/productsearch/datasheet/mlcc/UPY-GPHC_X5R_4V-to-50V_25.pdf; componentlink2description: DigiKey Link; componentlink2url: https://www.digikey.com/en/products/detail/yageo/CC0402KRX5R8BB105/5195107; Device Package: 0402 (1005 Metric); lastupdated: 09.02.2024 20:04:25; Lifecycle Status: Active; Minimum Order: 1; Mounting Type: Surface Mount, MLCC; Operating Temperature: -55°C ~ 85°C; Package / Case: 0402 (1005 Metric); partid: 9641; Part Status: Active; price: 0.04; Size / Dimension: 0.039" L x 0.020" W (1.00mm x 0.50mm); Supplier 1: DigiKey; Supplier Part Number 1: 311-1698-1-ND; Temperature Coefficient: X5R; Thickness (Max): 0.022" (0.55mm); Voltage - Rated: 25V
C72 C73 = CMP-03016-000019-1: CAP TANT POLY 47UF 35V 2917; Tolerance: 20%; Dissipation Factor: 10%; Life (Hours): 2000Hour; Polarity: Polar; ESR (Equivalent Series Resistance): 30mR; Mount: Surface Mount; Voltage Rating (DC): 35V; Height - Seated (Max): 0.169inch; Package Quantity: 1; Height: 4mm; Max Operating Temperature: 125°C; Width: 4.3mm; Packaging: Tape and Reel; Case/Package: 2917; Series: KO-CAP T521; Min Operating Temperature: -55°C; Depth: 4.3mm; Case Code (Metric): 7343; Number of Pins: 2; RoHS Compliant: Yes; Case Code (Imperial): 2917; Capacitance: 47uF; REACH SVHC: No SVHC; Features: General Purpose; Termination: SMD/SMT; Length: 7.3mm; Voltage Rating: 35V; Construction: Flat
CR1 = MBRD10200CT-13: No Description Available; Mfr_Name: Diodes Inc; Type: Diodes - Rectifiers, Arrays; RefDes: RefDes
D4 D20 = CMP-2000-05198-2: LED GREEN CLEAR SMD; Max Power Dissipation: 75mW; Forward Current: 30mA; Reverse Voltage: 5V; Lens Color: Colorless; Forward Voltage: 2V; Dominant Wavelength: 571nm; Number of LEDs: 1; Viewing Angle: 130°; Lens Style: Rectangular; Test Current: 20mA; Luminous Intensity: 35mcd; Wavelength: 574nm; Width: 0.8mm; Case Code (Imperial): 0603; Number of Pins: 2; Lead Free: Lead Free; Packaging: Tape and Reel; Package Quantity: 1; Min Operating Temperature: -55°C; Case/Package: 0603; Length: 1.6mm; Power Dissipation: 75mW; Depth: 0.8mm; Radiation Hardening: No; Mount: Surface Mount; Max Operating Temperature: 85°C; Color: Green; Power Rating: 75mW; Height: 0.55mm; Illumination Color: Green; Case Code (Metric): 1608; Lens Transparency: Clear; Number of Elements: 1
D23 = CMP-08607-000111-1: TVS DIODE 12V 19.9V DO214AB; Number of Channels: 1; Power Line Protection: No; Reverse Breakdown Voltage: 13.3V; Max Power Dissipation: 6.5W; Peak Pulse Current: 150.8A; Leakage Current: 2uA; Diode Type: ZENER; Power Dissipation: 3kW; Test Current: 1mA; Direction: Unidirectional; Max Breakdown Voltage: 14.7V; Lead Free: Lead Free; Packaging: Tape and Reel; Series: SMDJ; Number of Pins: 2; Resistor Type: Zener; Termination: SMD/SMT; RoHS Compliant: Yes; Number of Elements: 1; REACH SVHC: No SVHC; Min Breakdown Voltage: 13.3V; Mount: Surface Mount; Operating Supply Voltage: 12V; Polarity: Unidirectional; Breakdown Voltage: 13.3V; Max Surge Current: 150.8A; Clamping Voltage-Max: 19.9V; Clamping Voltage: 19.9V; Reverse Standoff Voltage: 12V; Max Operating Temperature: 150°C; Case/Package: DO-214AB; Package Quantity: 3000; Peak Pulse Power: 3kW; Min Operating Temperature: -55°C; Number of Unidirectional Channels: 1
F1 = FUSE_0603_2.00A: FUSE SLOW 5.00A 32V M 0603; VALENTIUM PART NUM: <VALENTIUM>; MFG NAME: BOURNS; MAXTEMP: 105C; MINTEMP: -40C; OTHER: UL E141069; P1: SLOW BLO; DESC: FUSE SLOW 1.25A 32V M 0603; MODIFY DATE: 9/4/2013; CATEGORY: FUSE; DATE: 20 OCT 15; P2: 32V; P3: M; SIZE: 0603; SHEETPART: *; Supplier 1: Digi-Key
J38 = CMP-2000-05600-2: CONN HEADER R/A 4POS 4.2MM; Manufacturer: Molex; Current Rating: 13A; Voltage Rating: 600V; Number Of Contacts: 4; Standoff Height: 0.4mm; Conn Orientation: Right Angle; Conn Gender: Male; Device Class L1: Connectors; Pitch: 4.2mm; Package: 39-30-0040; Octopart: https://octopart.com/39-30-0040-molex-277428; Mouser Description: Headers & Wire Housings 4 CKT R/A HEADER; Temperature Range High: +105°C; Number Of Rows: 2; ComponentLink2Description: Datasheet; ComponentLink2URL: https://www.molex.com/webdocs/datasheets/pdf/en-us/0039300040_PCB_HEADERS.pdf; Manufacturer Part Number: 39-30-0040; Contact Material: Gold,Nickel; Digikey Description: CONN HEADER R/A 4POS 4.2MM; Temperature: -40°C to +105°C; Automotive: No; Device Class L2: Headers and Wire Housings; RoHS: TRUE; Lead Free: Yes; Device Class L3: unset; Category: Conn; Footprint Url: https://www.molex.com/pdm_docs/sd/039300040_sd.pdf; Temperature Range Low: -40°C
R1 R77 = RC0402FR-07200RL: RES 200 OHM 1% 1/16W 0402; Manufacturer: Yageo; Temperature Coefficient: ±100ppm/°C; Power (Watts): 0.063W, 1/16W; Packaging: CutTape; Series: RC_L; Number of Terminations: 2; Resistance: 200 Ohms; Features: Moisture Resistant; Tolerance: ±1%; Part Number: RC0402FR-07200RL; Value: 200 Ohms; ComponentLink1Description: Datasheet; ComponentLink1URL: https://www.yageo.com/upload/media/product/productsearch/datasheet/rchip/PYu-RC_Group_51_RoHS_L_10.pdf; ComponentLink2Description: DigiKey Link; ComponentLink2URL: https://www.digikey.com/en/products/detail/yageo/RC0402FR-07200RL/2827569; Composition: Thick Film; Device Package: 0402 (1005 Metric); Height - Seated (Max): 0.016" (0.40mm); LastUpdated: 25.07.2024 9:18:11; Lifecycle Status: Active; Minimum Order: 1; Operating Temperature: -55°C ~ 155°C; Package / Case: 0402 (1005 Metric); PartId: 17915; Part Status: Active; Price: 0.01; Size / Dimension: 0.039" L x 0.020" W (1.00mm x 0.50mm); Supplier 1: DigiKey; Supplier Part Number 1: 311-200LRCT-ND; Supplier Device Package: 0402
R2 = CMP-2002-07394-1: Manufacturer: Yageo / Phycomp; Part Number: RC0402FR-07147KL
R3 R4 R62 R64-R66 R69 R79 R80 R187 R188 = RC0402FR-070RL: RES 0 OHM JUMPER 1/16W 0402; Manufacturer: Yageo; Power (Watts): 0.063W, 1/16W; Number of Terminations: 2; Packaging: CutTape; Composition: Thick Film; Resistance: 0 Ohms; Tolerance: Jumper; Part Number: RC0402FR-070RL; Value: 0 Ohms; ComponentLink1Description: Datasheet; ComponentLink1URL: https://www.yageo.com/upload/media/product/productsearch/datasheet/rchip/PYu-RC_Group_51_RoHS_L_10.pdf; ComponentLink2Description: DigiKey Link; ComponentLink2URL: https://www.digikey.com/en/products/detail/yageo/RC0402FR-070RL/2827570; Device Package: 0402 (1005 Metric); Features: Moisture Resistant; Height - Seated (Max): 0.016" (0.40mm); LastUpdated: 25.07.2024 9:18:11; Lifecycle Status: Active; Minimum Order: 1; Operating Temperature: -55°C ~ 155°C; Package / Case: 0402 (1005 Metric); PartId: 17630; Part Status: Active; Price: 0.01; Series: RC_L; Size / Dimension: 0.039" L x 0.020" W (1.00mm x 0.50mm); Supplier 1: DigiKey; Supplier Part Number 1: 311-0.0LRCT-ND; Supplier Device Package: 0402
R5 R70 = RC0402FR-074K7L: as R14 on sheet 01-USER_IO; Part Number: RC0402FR-074K7L; Value: 4.7 kOhms; ComponentLink1Description: Datasheet; ComponentLink1URL: https://www.yageo.com/upload/media/product/productsearch/datasheet/rchip/PYu-RC_Group_51_RoHS_L_10.pdf; ComponentLink2Description: DigiKey Link; ComponentLink2URL: https://www.digikey.com/en/products/detail/yageo/RC0402FR-074K7L/2827563; Composition: Thick Film; Device Package: 0402 (1005 Metric); Features: Moisture Resistant; Height - Seated (Max): 0.016" (0.40mm); LastUpdated: 25.07.2024 9:18:11; Lifecycle Status: Active; Minimum Order: 1; Number of Terminations: 2; Operating Temperature: -55°C ~ 155°C; Package / Case: 0402 (1005 Metric); Packaging: CutTape; PartId: 17603; Part Status: Active; Price: 0.01; Resistance: 4.7 kOhms; Series: RC_L; Size / Dimension: 0.039" L x 0.020" W (1.00mm x 0.50mm); Supplier 1: DigiKey; Supplier Part Number 1: 311-4.7KLRCT-ND; Supplier Device Package: 0402; Tolerance: ±1%
R6 R9 R129 R183 = CMP-2002-06039-1: Part Number: MC00625W0402120K; Manufacturer: Multicomp
R7 R8 R72 = CMP-2003-04334-1: Manufacturer: Vishay Dale; Part Number: WSL12062L000FEA18
R26 = CMP-2002-05839-1: Part Number: ERA-2AED122X; Manufacturer: Panasonic
R27 = CMP-03412-035461-1: RES SMD 160 OHM 0.5% 1/16W 0402; Manufacturer Part Number: RT0402DRE07160RL; Manufacturer: Yageo; Tolerance: 0.005; Value: 160Ω; Voltage Rating: 50V; Temperature Coefficient: 50 ppm/°C; Power Rating: 0.063W; Device Class L1: Passive Components; Device Class L2: Resistors; Device Class L3: Chip SMD Resistors; Package: RT0402; Height: 0.35mm; Octopart: https://octopart.com/rt0402dre07160rl-yageo-1216058; Temperature Range High: +155°C; ComponentLink2URL: http://www.yageo.com/documents/recent/PYu-RT_1-to-0.01_RoHS_L_9.pdf; Temperature Range Low: -55°C; Temperature: -55°C to +155°C; Ipc Land Pattern Name: RESC10050X30; Footprint Url: http://www.yageo.com/exep/pages/download/literatures/PYu-R_Mount_10.pdf; Series: RT; Composition: Thin Film; Automotive: No; Resistance: 160Ω; ComponentLink2Description: Datasheet; Category: Res; Lead Free: Yes; Digikey Description: RES SMD 160 OHM 0.5% 1/16W 0402; RoHS: TRUE
R44 = CMP-2003-04873-1: Part Number: CRCW12060000Z0EAHP; Manufacturer: Vishay Dale
R59 R60 R184 R185 = RC0402FR-0710KL: RES 10K OHM 1% 1/16W 0402; Manufacturer: Yageo; Power (Watts): 0.063W, 1/16W; Temperature Coefficient: ±100ppm/°C; Part Number: RC0402FR-0710KL; Value: 10 kOhms; ComponentLink1Description: Datasheet; ComponentLink1URL: https://www.yageo.com/upload/media/product/productsearch/datasheet/rchip/PYu-RC_Group_51_RoHS_L_10.pdf; ComponentLink2Description: DigiKey Link; ComponentLink2URL: https://www.digikey.com/en/products/detail/yageo/RC0402FR-0710KL/726523; Composition: Thick Film; Device Package: 0402 (1005 Metric); Features: Moisture Resistant; Height - Seated (Max): 0.016" (0.40mm); LastUpdated: 25.07.2024 9:18:11; Lifecycle Status: Active; Minimum Order: 1; Number of Terminations: 2; Operating Temperature: -55°C ~ 155°C; Package / Case: 0402 (1005 Metric); Packaging: CutTape; PartId: 17593; Part Status: Active; Price: 0.01; Resistance: 10 kOhms; Series: RC_L; Size / Dimension: 0.039" L x 0.020" W (1.00mm x 0.50mm); Supplier 1: DigiKey; Supplier Part Number 1: 311-10.0KLRCT-ND; Supplier Device Package: 0402; Tolerance: ±1%
R61 = CMP-2002-05848-1: Part Number: ERA-2AED222X; Manufacturer: Panasonic
R63 = CMP-2002-01415-2: Automotive Metal Thin Film Chip Resistor, 0402, 22Ω, 0.5%, 100ppm/°C, 0.0625W, 75V; Voltage Rating (DC): 25V; Max Power Dissipation: 63mW; Resistance: 22R; Temperature Coefficient: 100ppm/°C; RoHS Compliant: Yes; Voltage Rating: 75V; Height: 0.016inch; Lead Free: Lead Free; Packaging: Tape and Reel; Termination: SMD/SMT; Length: 0.039inch; Package Quantity: 1; Weight: 2.3E-05oz; Case/Package: 0402; Power Rating: 63mW; Case Code (Metric): 1005; Max Operating Temperature: 155°C; Series: RG; Width: 0.02inch; Number of Terminations: 2; Features: Automotive AEC-Q200; Min Operating Temperature: -55°C; Case Code (Imperial): 0402; Tolerance: 0.5%; Resistor Type: Thin Film
R67 = CMP-2002-03021-2: RES SMD 88.7K OHM 0.5% 1/16W; Manufacturer: Yageo; Manufacturer Part Number: RT0402DRE0788K7L; Voltage Rating: 50V; Power Rating: 0.063W; Value: 88.7KΩ; Temperature Coefficient: 50 ppm/°C; Tolerance: 0.005; Temperature Range High: +155°C; Composition: Thin Film; ComponentLink2Description: Datasheet; RoHS: TRUE; Category: Res; Ipc Land Pattern Name: RESC10050X30; Octopart: https://octopart.com/rt0402dre0788k7l-yageo-1439224; ComponentLink2URL: http://www.yageo.com/documents/recent/PYu-RT_1-to-0.01_RoHS_L_9.pdf; Digikey Description: RES SMD 88.7K OHM 0.5% 1/16W; Height: 0.35mm; Series: RT; Footprint Url: http://www.yageo.com/exep/pages/download/literatures/PYu-R_Mount_10.pdf; Device Class L2: Resistors; Temperature: -55°C to +155°C; Temperature Range Low: -55°C; Package: RT0402; Device Class L1: Passive Components; Automotive: No; Lead Free: Yes; Device Class L3: Chip SMD Resistors; Resistance: 88.7KΩ
R68 = CMP-2002-02670-1: Part Number: RT0402DRD072KL; Manufacturer: Yageo
U1 U24 = MUN12AD06-SM: No Description Available; Mfr_Name: Cyntec; RefDes: RefDes; Type: Type
U2 U17 U19 = CMP-0704-00005-3: IC MONITOR PWR/CURR BIDIR 8-SOIC; Min Supply Voltage: 3V; Common Mode Rejection Ratio: 100dB; Output Current: 10mA; Number of Amplifiers: 1; Accuracy: 0.5%; Supply Current: 1mA; Quiescent Current: 700uA; Bandwidth: 11kHz; Input Offset Voltage (Vos): 40uV; Max Supply Voltage: 5.5V; Packaging: Tape and Reel; REACH SVHC: No SVHC; Max Operating Temperature: 125°C; Number of Pins: 8; Lead Free: Lead Free; Package Quantity: 1; Radiation Hardening: No; Case/Package: SOIC; Min Operating Temperature: -40°C; Contact Plating: Gold; Series: Zero-Drift; Nominal Supply Current: 1mA; RoHS Compliant: Yes
U5 U18 = CMP-20596-000049-1: DC DC CONVERTER 0.7-5V; Number of Outputs: 1; Max Output Current: 6A; Efficiency: 95%; Max Input Voltage: 14V; Voltage - Output 1: 5V; Min Input Voltage: 8V; Case/Package: SMD/SMT; Mount: Surface Mount; RoHS Compliant: Yes; Packaging: Tape and Reel; Min Operating Temperature: -40°C; Features: UVLO; Max Operating Temperature: 85°C

## Sheet 04-PCIe_JTAG.SchDoc
size Tabloid; Customer: 01910
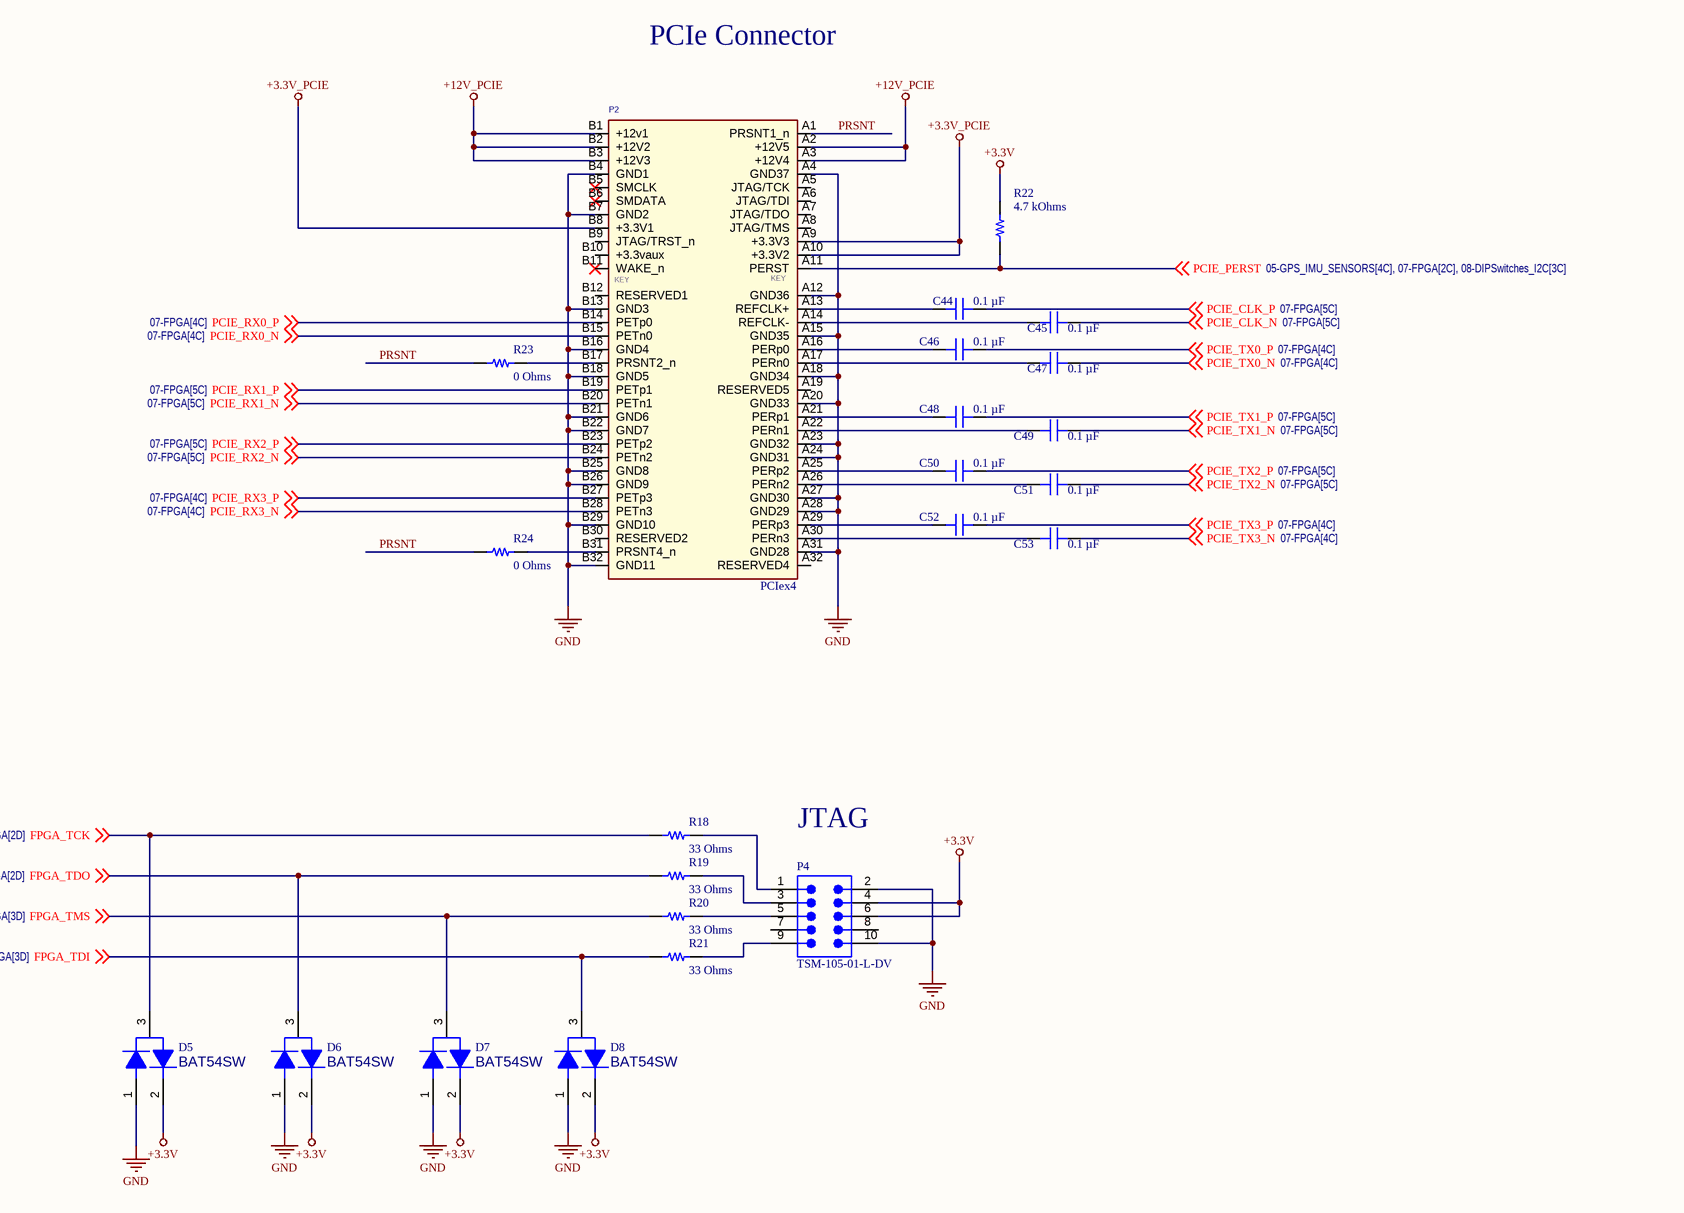
[diagram p3: 04-PCIe_JTAG.SchDoc]

### Parts
C44  0.1 µF  [CAP 0402_1005]
C45  0.1 µF  [CAP 0402_1005]
C46  0.1 µF  [CAP 0402_1005]
C47  0.1 µF  [CAP 0402_1005]
C48  0.1 µF  [CAP 0402_1005]
C49  0.1 µF  [CAP 0402_1005]
C50  0.1 µF  [CAP 0402_1005]
C51  0.1 µF  [CAP 0402_1005]
C52  0.1 µF  [CAP 0402_1005]
C53  0.1 µF  [CAP 0402_1005]
D5  BAT54SW  [SOT65P210X110-3N]
D6  BAT54SW  [SOT65P210X110-3N]
D7  BAT54SW  [SOT65P210X110-3N]
D8  BAT54SW  [SOT65P210X110-3N]
P2  PCIex4  [PCIE_4LANE_EDGE]  (no BOM)
P4  TSM-105-01-L-DV  [SMTC-TSM-105-01-X-DV]
R18  33 Ohms  [YAGEO RES 0805_2012]
R19  33 Ohms  [YAGEO RES 0805_2012]
R20  33 Ohms  [YAGEO RES 0805_2012]
R21  33 Ohms  [YAGEO RES 0805_2012]
R22  4.7 kOhms  [YAGEO RES 0402_1005]
R23  0 Ohms  [YAGEO RES 0402_1005]
R24  0 Ohms  [YAGEO RES 0402_1005]

### Nets
+3.3V: D5.2 D6.2 D7.2 D8.2 P4.4 P4.6 R22.2
+3.3V_PCIE: P2.A9(+3.3V3) P2.A10(+3.3V2) P2.B8(+3.3V1)
+12V_PCIE: P2.A2(+12V5) P2.A3(+12V4) P2.B1(+12v1) P2.B2(+12V2) P2.B3(+12V3)
GND: D5.1 D6.1 D7.1 D8.1 P2.A4(GND37) P2.A12(GND36) P2.A15(GND35) P2.A18(GND34) P2.A20(GND33) P2.A23(GND32) P2.A24(GND31) P2.A27(GND30) P2.A28(GND29) P2.A31(GND28) P2.B4(GND1) P2.B7(GND2) P2.B13(GND3) P2.B16(GND4) P2.B18(GND5) P2.B21(GND6) P2.B22(GND7) P2.B25(GND8) P2.B26(GND9) P2.B29(GND10) P2.B32(GND11) P4.2 P4.10
FPGA_TCK: D5.3 R18.1 ; off-sheet FPGA_TCK
FPGA_TDI: D8.3 R21.1 ; off-sheet FPGA_TDI
FPGA_TDO: D6.3 R19.1 ; off-sheet FPGA_TDO
FPGA_TMS: D7.3 R20.1 ; off-sheet FPGA_TMS
PCIE_CLK_N: C45.2 ; off-sheet PCIE_CLK_N
PCIE_CLK_P: C44.2 ; off-sheet PCIE_CLK_P
PCIE_PERST: P2.A11(PERST) R22.1 ; off-sheet PCIE_PERST
PCIE_RX0_N: P2.B15(PETn0) ; off-sheet PCIE_RX0_N
PCIE_RX0_P: P2.B14(PETp0) ; off-sheet PCIE_RX0_P
PCIE_RX1_N: P2.B20(PETn1) ; off-sheet PCIE_RX1_N
PCIE_RX1_P: P2.B19(PETp1) ; off-sheet PCIE_RX1_P
PCIE_RX2_N: P2.B24(PETn2) ; off-sheet PCIE_RX2_N
PCIE_RX2_P: P2.B23(PETp2) ; off-sheet PCIE_RX2_P
PCIE_RX3_N: P2.B28(PETn3) ; off-sheet PCIE_RX3_N
PCIE_RX3_P: P2.B27(PETp3) ; off-sheet PCIE_RX3_P
PCIE_TX0_N: C47.2 ; off-sheet PCIE_TX0_N
PCIE_TX0_P: C46.2 ; off-sheet PCIE_TX0_P
PCIE_TX1_N: C49.2 ; off-sheet PCIE_TX1_N
PCIE_TX1_P: C48.2 ; off-sheet PCIE_TX1_P
PCIE_TX2_N: C51.2 ; off-sheet PCIE_TX2_N
PCIE_TX2_P: C50.2 ; off-sheet PCIE_TX2_P
PCIE_TX3_N: C53.2 ; off-sheet PCIE_TX3_N
PCIE_TX3_P: C52.2 ; off-sheet PCIE_TX3_P
PRSNT: P2.A1(PRSNT1_n) R23.1 R24.1
NetC44_1: C44.1 P2.A13(REFCLK+)
NetC45_1: C45.1 P2.A14(REFCLK-)
NetC46_1: C46.1 P2.A16(PERp0)
NetC47_1: C47.1 P2.A17(PERn0)
NetC48_1: C48.1 P2.A21(PERp1)
NetC49_1: C49.1 P2.A22(PERn1)
NetC50_1: C50.1 P2.A25(PERp2)
NetC51_1: C51.1 P2.A26(PERn2)
NetC52_1: C52.1 P2.A29(PERp3)
NetC53_1: C53.1 P2.A30(PERn3)
NetP2_B17: P2.B17(PRSNT2_n) R23.2
NetP2_B31: P2.B31(PRSNT4_n) R24.2
NetP4_1: P4.1 R18.2
NetP4_3: P4.3 R19.2
NetP4_5: P4.5 R20.2
NetP4_9: P4.9 R21.2

Not connected (* = marked no-connect by the designer): P2 A5(JTAG/TCK) A6(JTAG/TDI) A7(JTAG/TDO) A8(JTAG/TMS) A19(RESERVED5) A32(RESERVED4) B5(SMCLK)* B6(SMDATA)* B9(JTAG/TRST_n) B10(+3.3vaux) B11(WAKE_n)* B12(RESERVED1) B30(RESERVED2); P4 7 8

### Notes on the sheet
- PCIe Connector
- JTAG
- SHEET
- REV
- timingcard.com <http://timingcard.com>
- DATE
- OF
- (in symbol PCIex4) KEY

### Library data of the parts
C44-C53 = CC0402KRX7R9BB104: as C26 on sheet 01-USER_IO; Supplier 1: DigiKey; Supplier Part Number 1: 311-3566-1-ND; Value: 0.1 µF; Part Number: CC0402KRX7R9BB104; Applications: General Purpose; Capacitance: 0.1 µF; componentlink1description: Datasheet; componentlink1url: https://www.yageo.com/upload/media/product/productsearch/datasheet/mlcc/UPY-GPHC_X7R_6.3V-to-50V_18.pdf; componentlink2description: DigiKey Link; componentlink2url: https://www.digikey.com/en/products/detail/yageo/CC0402KRX7R9BB104/5883371; Device Package: 0402 (1005 Metric); lastupdated: 09.02.2024 20:04:27; Lifecycle Status: Active; Minimum Order: 10; Mounting Type: Surface Mount, MLCC; Operating Temperature: -55°C ~ 125°C; Package / Case: 0402 (1005 Metric); packaging: TapeAndReel; partid: 8451; Part Status: Active; price: 0.01; series: CC; Size / Dimension: 0.039" L x 0.020" W (1.00mm x 0.50mm); Temperature Coefficient: X7R; Thickness (Max): 0.022" (0.55mm); Voltage - Rated: 50V
D5-D8 = BAT54SW: DIO, SCHOTTKY, BAT54S, DUAL SERIES, 30V, 200MA, SC-70; MFG PART NUM: BAT54SWQ-7-F; VALENTIUM PART NUM: <VALENTIUM>; MFG NAME: DIODES INC; MAXTEMP: 150C; MINTEMP: -55C; P3: 200mA,200mW; MODIFY DATE: 9/4/2013; CATEGORY: DIO, SCHOTTKY; OTHER: SERIES; P1: SCHOTTKY; P2: 30V; SIZE: SC-70; SHEETPART: *; DESC: DIO, SCHOTTKY, BAT54S, DUAL SERIES, 30V, 200MA, SC-70; Supplier 1: Digi-Key; Supplier Part Number 1: BAT54SWQ-7-FDICT-ND; VALUE: BAT54SW
P2 = PCIex4: PCIE x4 Edge Connector,OrCAD Symbol,NC; Part Number: 451; Manufacturer: NA; NOTE: NC; Vendor P/N: NA; Part Type: SMT
P4 = CMP-1024-00233-1: 0.025" SQ Post Header, Surface Mount, Vertical, -55 to 125 degC, 2.54 mm Pitch, 10-Pin, Male, RoHS; Manufacturer: Samtec; Pitch: 2.54 mm; ComponentLink1URL: http://www.samtec.com; DatasheetVersion: F-214; ComponentLink3URL: http://www.samtec.com/documents/webfiles/cpdf/TSM-1XX-XX-XXX-XX-X-XXX-X-MKT.pdf; Temperature Range: -55 to 125 degC; PackageDescription: Double Row Gullwing ASM; PartNumber: TSM-105-01-L-DV; ComponentLink2URL: http://www.samtec.com/documents/webfiles/pdf/TSM.PDF; ComponentLink2Description: Datasheet; Mounting Technology: Surface Mount; PackageVersion: DJ, 4/1991; RoHS: True; ComponentLink3Description: Package Specification; PackageReference: TSM-105-01-X-DV; Orientation: Vertical; ComponentLink1Description: Manufacturer URL
R18-R21 = RC0805FR-0733RL: RES 33 OHM 1% 1/8W 0805; Manufacturer: Yageo; Power (Watts): 0.125W, 1/8W; Temperature Coefficient: ±100ppm/°C; Supplier 1: DigiKey; Supplier Part Number 1: 311-33.0CRCT-ND; Value: 33 Ohms; Part Number: RC0805FR-0733RL; ComponentLink1Description: Datasheet; ComponentLink1URL: https://www.yageo.com/upload/media/product/productsearch/datasheet/rchip/PYu-RC_Group_51_RoHS_L_10.pdf; ComponentLink2Description: DigiKey Link; ComponentLink2URL: https://www.digikey.com/en/products/detail/yageo/RC0805FR-0733RL/727862; Composition: Thick Film; Device Package: 0805 (2012 Metric); Features: Moisture Resistant; Height - Seated (Max): 0.024" (0.60mm); LastUpdated: 25.07.2024 9:20:22; Lifecycle Status: Active; Minimum Order: 1; Number of Terminations: 2; Operating Temperature: -55°C ~ 155°C; Package / Case: 0805 (2012 Metric); Packaging: TapeAndReel; PartId: 39462; Part Status: Active; Price: 0.01; Resistance: 33 Ohms; Series: RC_L; Size / Dimension: 0.079" L x 0.049" W (2.00mm x 1.25mm); Supplier Device Package: 0805; Tolerance: ±1%
R22 = RC0402FR-074K7L: as R14 on sheet 01-USER_IO; Supplier 1: DigiKey; Supplier Part Number 1: 311-4.7KLRCT-ND; Value: 4.7 kOhms; Part Number: RC0402FR-074K7L; ComponentLink1Description: Datasheet; ComponentLink1URL: https://www.yageo.com/upload/media/product/productsearch/datasheet/rchip/PYu-RC_Group_51_RoHS_L_10.pdf; ComponentLink2Description: DigiKey Link; ComponentLink2URL: https://www.digikey.com/en/products/detail/yageo/RC0402FR-074K7L/2827563; Composition: Thick Film; Device Package: 0402 (1005 Metric); Features: Moisture Resistant; Height - Seated (Max): 0.016" (0.40mm); LastUpdated: 25.07.2024 9:18:11; Lifecycle Status: Active; Minimum Order: 1; Number of Terminations: 2; Operating Temperature: -55°C ~ 155°C; Package / Case: 0402 (1005 Metric); Packaging: CutTape; PartId: 17603; Part Status: Active; Price: 0.01; Resistance: 4.7 kOhms; Series: RC_L; Size / Dimension: 0.039" L x 0.020" W (1.00mm x 0.50mm); Supplier Device Package: 0402; Tolerance: ±1%
R23 R24 = RC0402FR-070RL: as R3 on sheet 03-POWER; Supplier 1: DigiKey; Supplier Part Number 1: 311-0.0LRCT-ND; Value: 0 Ohms; Part Number: RC0402FR-070RL; ComponentLink1Description: Datasheet; ComponentLink1URL: https://www.yageo.com/upload/media/product/productsearch/datasheet/rchip/PYu-RC_Group_51_RoHS_L_10.pdf; ComponentLink2Description: DigiKey Link; ComponentLink2URL: https://www.digikey.com/en/products/detail/yageo/RC0402FR-070RL/2827570; Composition: Thick Film; Device Package: 0402 (1005 Metric); Features: Moisture Resistant; Height - Seated (Max): 0.016" (0.40mm); LastUpdated: 25.07.2024 9:18:11; Lifecycle Status: Active; Minimum Order: 1; Number of Terminations: 2; Operating Temperature: -55°C ~ 155°C; Package / Case: 0402 (1005 Metric); Packaging: CutTape; PartId: 17630; Part Status: Active; Price: 0.01; Resistance: 0 Ohms; Series: RC_L; Size / Dimension: 0.039" L x 0.020" W (1.00mm x 0.50mm); Supplier Device Package: 0402; Tolerance: Jumper